# EAGLE schematic MarioCube_V2 (EAGLE 6.2)
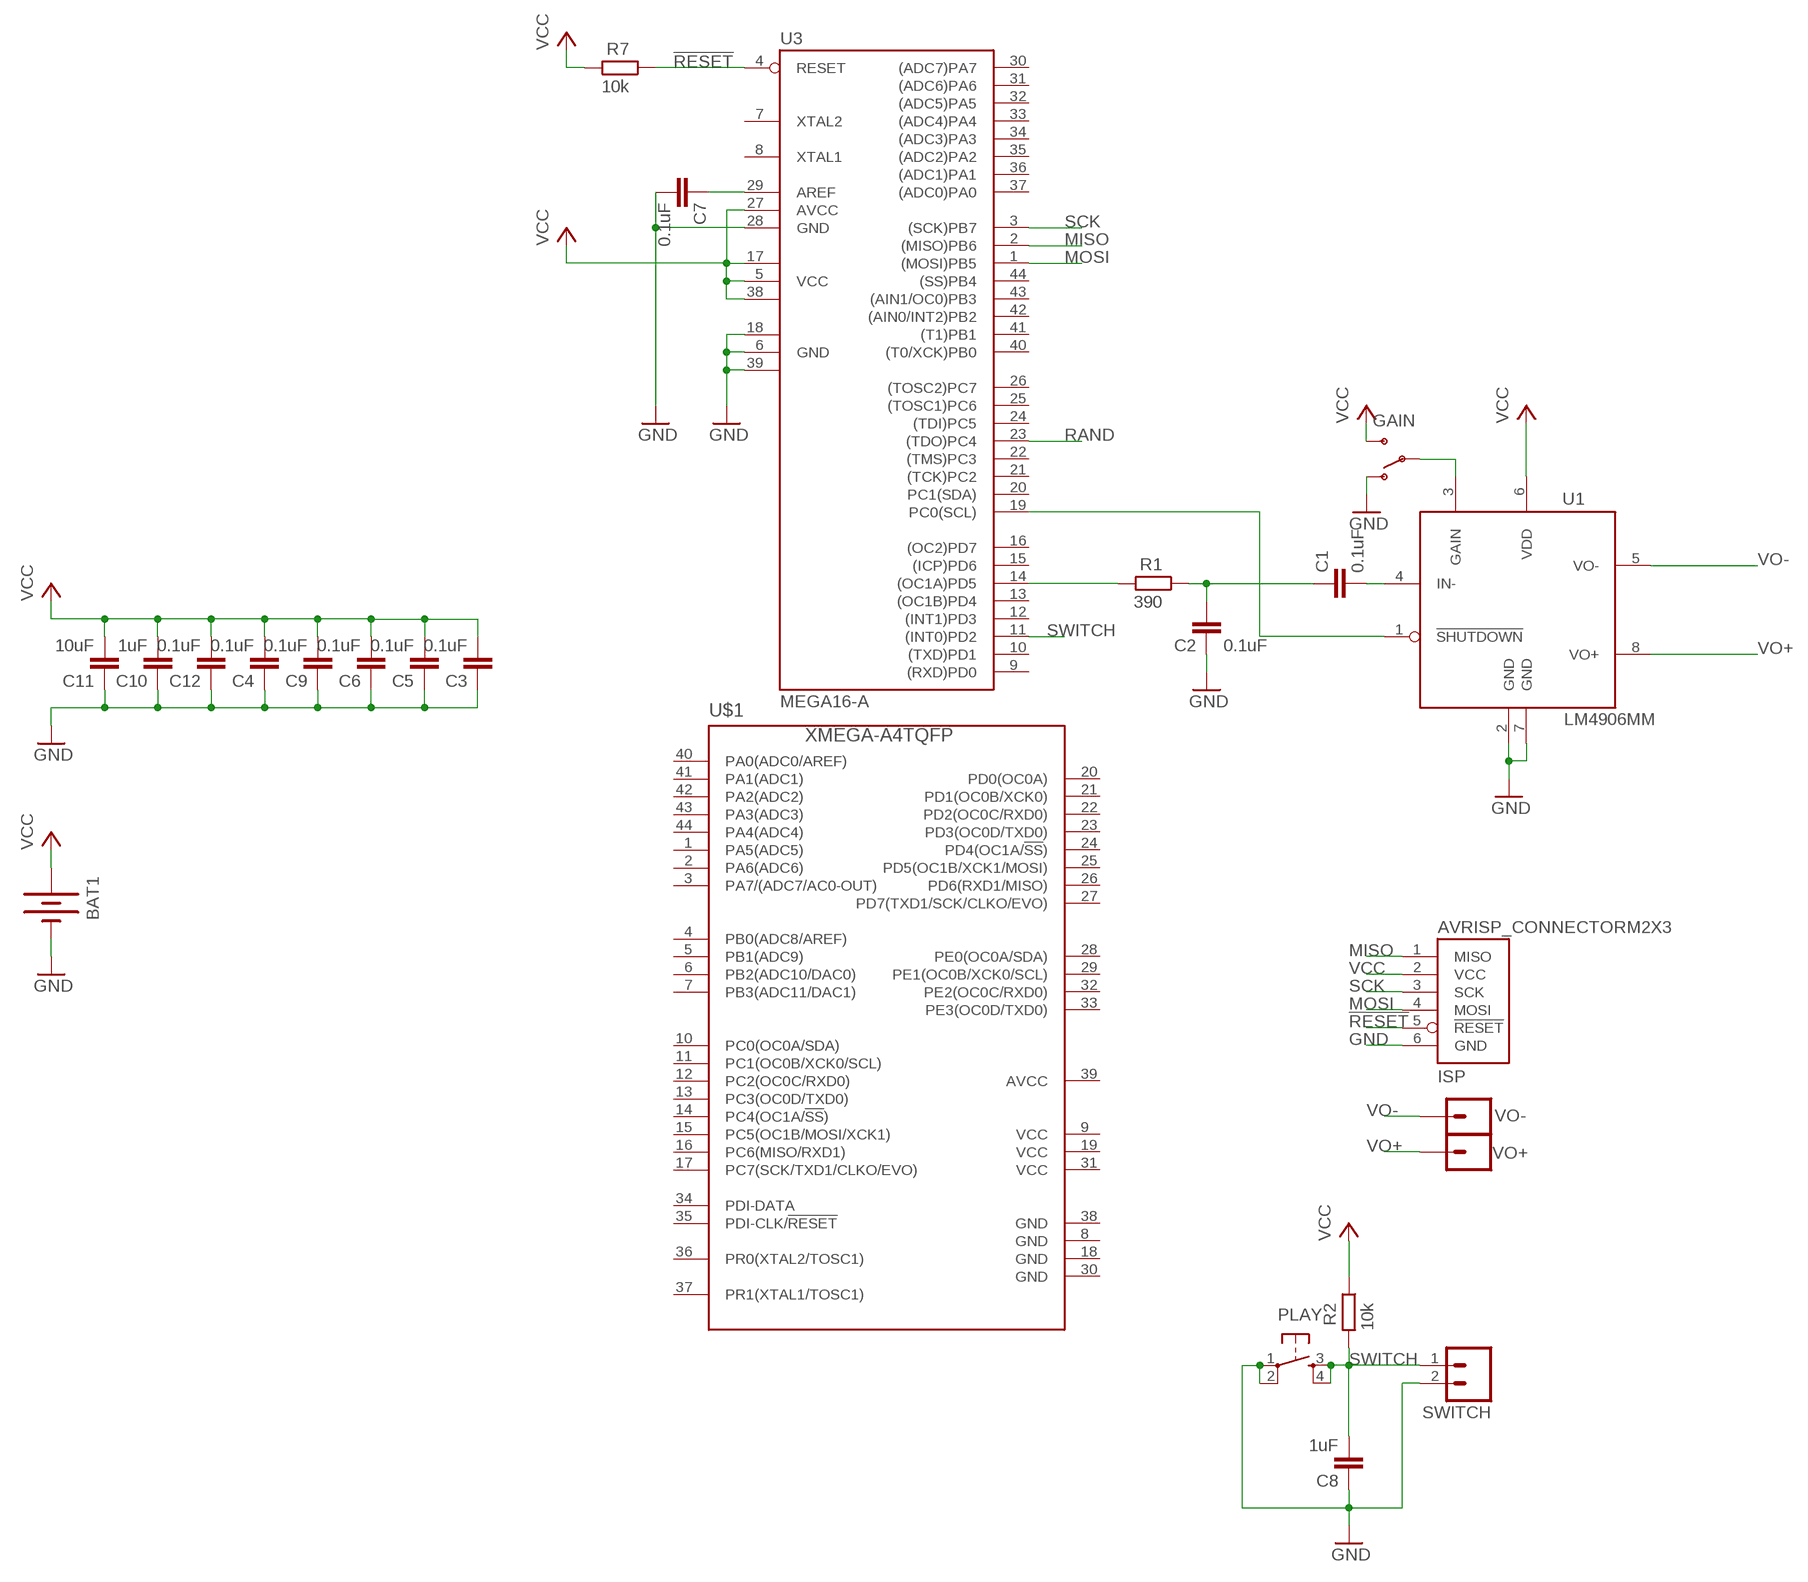
[diagram p0: schematic, sheet 1]

## Parts
BAT1  BATTERY2XAAA-2468  [BATTERY_HOLDER_2468]
C1  0.1uF  C-EUC0603K  [C0603K]
C2  0.1uF  C-EUC0603K  [C0603K]
C3  0.1uF  C-EUC0603K  [C0603K]
C4  0.1uF  C-EUC0603K  [C0603K]
C5  0.1uF  C-EUC0603K  [C0603K]
C6  0.1uF  C-EUC0603K  [C0603K]
C7  0.1uF  C-EUC0603K  [C0603K]
C8  1uF  C-EUC0603K  [C0603K]
C9  0.1uF  C-EUC0603K  [C0603K]
C10  1uF  C-EUC0805K  [C0805K]
C11  10uF  C-EUC0805K  [C0805K]
C12  0.1uF  C-EUC0603K  [C0603K]
GAIN  SWITCH-SPSTSMD  [AYZ0202]
ISP  AVRISP_CONNECTORM2X3  [2X3]
PLAY  TAC_SWITCHSMD  [TACTILE_SWITCH_SMD]
R1  390  R-EU_R0603  [R0603]
R2  10k  R-EU_R0603  [R0603]
R7  10k  R-EU_R0603  [R0603]
SWITCH  M02LOCK  [1X02_LOCK]
U1  LM4906MM  [MSOP8]
U3  MEGA16-A  [TQFP44]
U$1  XMEGA-A4TQFP  [TQFP44]
VO+  M01OFFSET  [1X01_OFFSET]
VO-  M01OFFSET  [1X01_OFFSET]

## Nets
!RESET: ISP.5(!RESET) R7.1 U3.4(RESET)
GND: BAT1.GND@1(-) C2.1 C3.1 C4.1 C5.1 C6.1 C7.2 C8.1 C9.1 C10.1 C11.1 C12.1 GAIN.1(O) ISP.6(GND) PLAY.1 PLAY.2 SWITCH.2 U1.2(GND) U1.7(GND) U3.6(GND) U3.18(GND1) U3.28(GND) U3.39(GND2)
MISO: ISP.1(MISO) U3.2((MISO)PB6)
MOSI: ISP.4(MOSI) U3.1((MOSI)PB5)
N$1: C1.2 U1.4(IN-)
N$2: U1.1(!SHUTDOWN) U3.19(PC0(SCL))
N$3: C1.1 C2.2 R1.1
N$4: GAIN.2(P) U1.3(GAIN)
N$5: R1.2 U3.14((OC1A)PD5)
N$8: C7.1 U3.29(AREF)
RAND: U3.23((TDO)PC4)
SCK: ISP.3(SCK) U3.3((SCK)PB7)
SWITCH: C8.2 PLAY.3 PLAY.4 R2.2 SWITCH.1 U3.11((INT0)PD2)
VCC: BAT1.PWR@1(+) C3.2 C4.2 C5.2 C6.2 C9.2 C10.2 C11.2 C12.2 GAIN.3(S) ISP.2(VCC) R2.1 R7.2 U1.6(VDD) U3.5(VCC) U3.17(VCC1) U3.27(AVCC) U3.38(VCC2)
VO+: U1.8(VO+) VO+.1
VO-: U1.5(VO-) VO-.1
Unconnected: U3.7(XTAL2) U3.8(XTAL1) U3.9((RXD)PD0) U3.10((TXD)PD1) U3.12((INT1)PD3) U3.13((OC1B)PD4) U3.15((ICP)PD6) U3.16((OC2)PD7) U3.20(PC1(SDA)) U3.21((TCK)PC2) U3.22((TMS)PC3) U3.24((TDI)PC5) U3.25((TOSC1)PC6) U3.26((TOSC2)PC7) U3.30((ADC7)PA7) U3.31((ADC6)PA6) U3.32((ADC5)PA5) U3.33((ADC4)PA4) U3.34((ADC3)PA3) U3.35((ADC2)PA2) U3.36((ADC1)PA1) U3.37((ADC0)PA0) U3.40((T0/XCK)PB0) U3.41((T1)PB1) U3.42((AIN0/INT2)PB2) U3.43((AIN1/OC0)PB3) U3.44((SS)PB4) U$1.1(PA5(ADC5)) U$1.2(PA6(ADC6)) U$1.3(PA7/(ADC7/AC0-OUT)) U$1.4(PB0(ADC8/AREF)) U$1.5(PB1(ADC9)) U$1.6(PB2(ADC10/DAC0)) U$1.7(PB3(ADC11/DAC1)) U$1.10(PC0(OC0A/SDA)) U$1.11(PC1(OC0B/XCK0/SCL)) U$1.12(PC2(OC0C/RXD0)) U$1.13(PC3(OC0D/TXD0)) U$1.14(PC4(OC1A/!SS!)) U$1.15(PC5(OC1B/MOSI/XCK1)) U$1.16(PC6(MISO/RXD1)) U$1.17(PC7(SCK/TXD1/CLKO/EVO)) U$1.20(PD0(OC0A)) U$1.21(PD1(OC0B/XCK0)) U$1.22(PD2(OC0C/RXD0)) U$1.23(PD3(OC0D/TXD0)) U$1.24(PD4(OC1A/!SS!)) U$1.25(PD5(OC1B/XCK1/MOSI)) U$1.26(PD6(RXD1/MISO)) U$1.27(PD7(TXD1/SCK/CLKO/EVO)) U$1.28(PE0(OC0A/SDA)) U$1.29(PE1(OC0B/XCK0/SCL)) U$1.32(PE2(OC0C/RXD0)) U$1.33(PE3(OC0D/TXD0)) U$1.34(PDI-DATA) U$1.35(PDI-CLK/!RESET) U$1.36(PR0(XTAL2/TOSC1)) U$1.37(PR1(XTAL1/TOSC1)) U$1.40(PA0(ADC0/AREF)) U$1.41(PA1(ADC1)) U$1.42(PA2(ADC2)) U$1.43(PA3(ADC3)) U$1.44(PA4(ADC4))

## Power pins joined to a net without a drawn wire
AVCC: U$1.39(AVCC)
GND: U$1.8(GND) U$1.18(GND) U$1.30(GND) U$1.38(GND)
VCC: U$1.9(VCC) U$1.19(VCC) U$1.31(VCC)

## Library data of the parts
BAT1 = V2_:BATTERY: Battery Holders Various common sizes : AA, AAA, 20mm coin cell and 12mm coin cell.; DIGIKEY: BK-912-CT-ND
C1-C12 = rcl:C-EU: CAPACITOR, European symbol
GAIN = SparkFun:SWITCH-SPST: SPST Switch Simple slide switch. Spark Fun Electronics SKU : COM-00102; DIGIKEY: 401-2013-1-ND
ISP = V2_:AVRISP_CONNECTOR
PLAY = SparkFun:TAC_SWITCH: Momentary Switch Button commonly used for reset or general input. Spark Fun Electronics SKU : COM-00097; DIGIKEY: CKN9104CT-ND
R1 R2 R7 = rcl:R-EU_: RESISTOR, European symbol
SWITCH = SparkFun:M02: Header 2 Standard 2-pin 0.1" header. Use with straight break away headers (SKU : PRT-00116), right angle break away headers (PRT-00553), swiss pins (PRT-00743), machine pins (PRT-00117), and female headers (PRT-00115). Molex polarized connector foot print use with SKU : PRT-08233 with associated crimp pins and housings.
U1 = V2_:LM4906: LM4906 Boomer 1W, Bypass-Capacitor-less Audio Amplifier with Internal Selectable Gain
U3 = atmel:MEGA16: MICROCONTROLLER 16 Kbytes FLASH 1 kbytes SRAM 512 bytes EEPROM USART 8-channel 10 bit ADC Source: avr.lbr; MPN: ATMEGA16-16AU; OC_FARNELL: 9171134; OC_NEWARK: 96K6515
U$1 = avr-7:XMEGA-A4: Atmel XMega A4 series processor
VO+ VO- = SparkFun:M01: Header 1 Standard 1-pin 0.1" header. Use with straight break away headers (SKU : PRT-00116), right angle break away headers (PRT-00553), swiss pins (PRT-00743), machine pins (PRT-00117), and female headers (PRT-00115).